# Altium schematic sheet 005_DCDC & PMIC.SchDoc
size 420 x 297 mm; Page Create Date: May 29, 2006; WebSite: https://www.seeedstudio.com; Page Number: 5; Drawing: qxn; Schematic Name: BeaglePlay; Page Size: A3; Comment: Seeed Title; Page Count: 22; Page Name: 005_DCDC & PMIC; Company: Seeed Studio; RevCode: v0.2; DsnPath: C:\Users\a0488739\Documents\GitHub\beagleplay\allegro\DVT\BEAGLEPLAYV020_220915.DSN; SchematicName: BeaglePlay; PageName: 005_DCDC & PMIC; PageSize: A3; TopSchematic: True
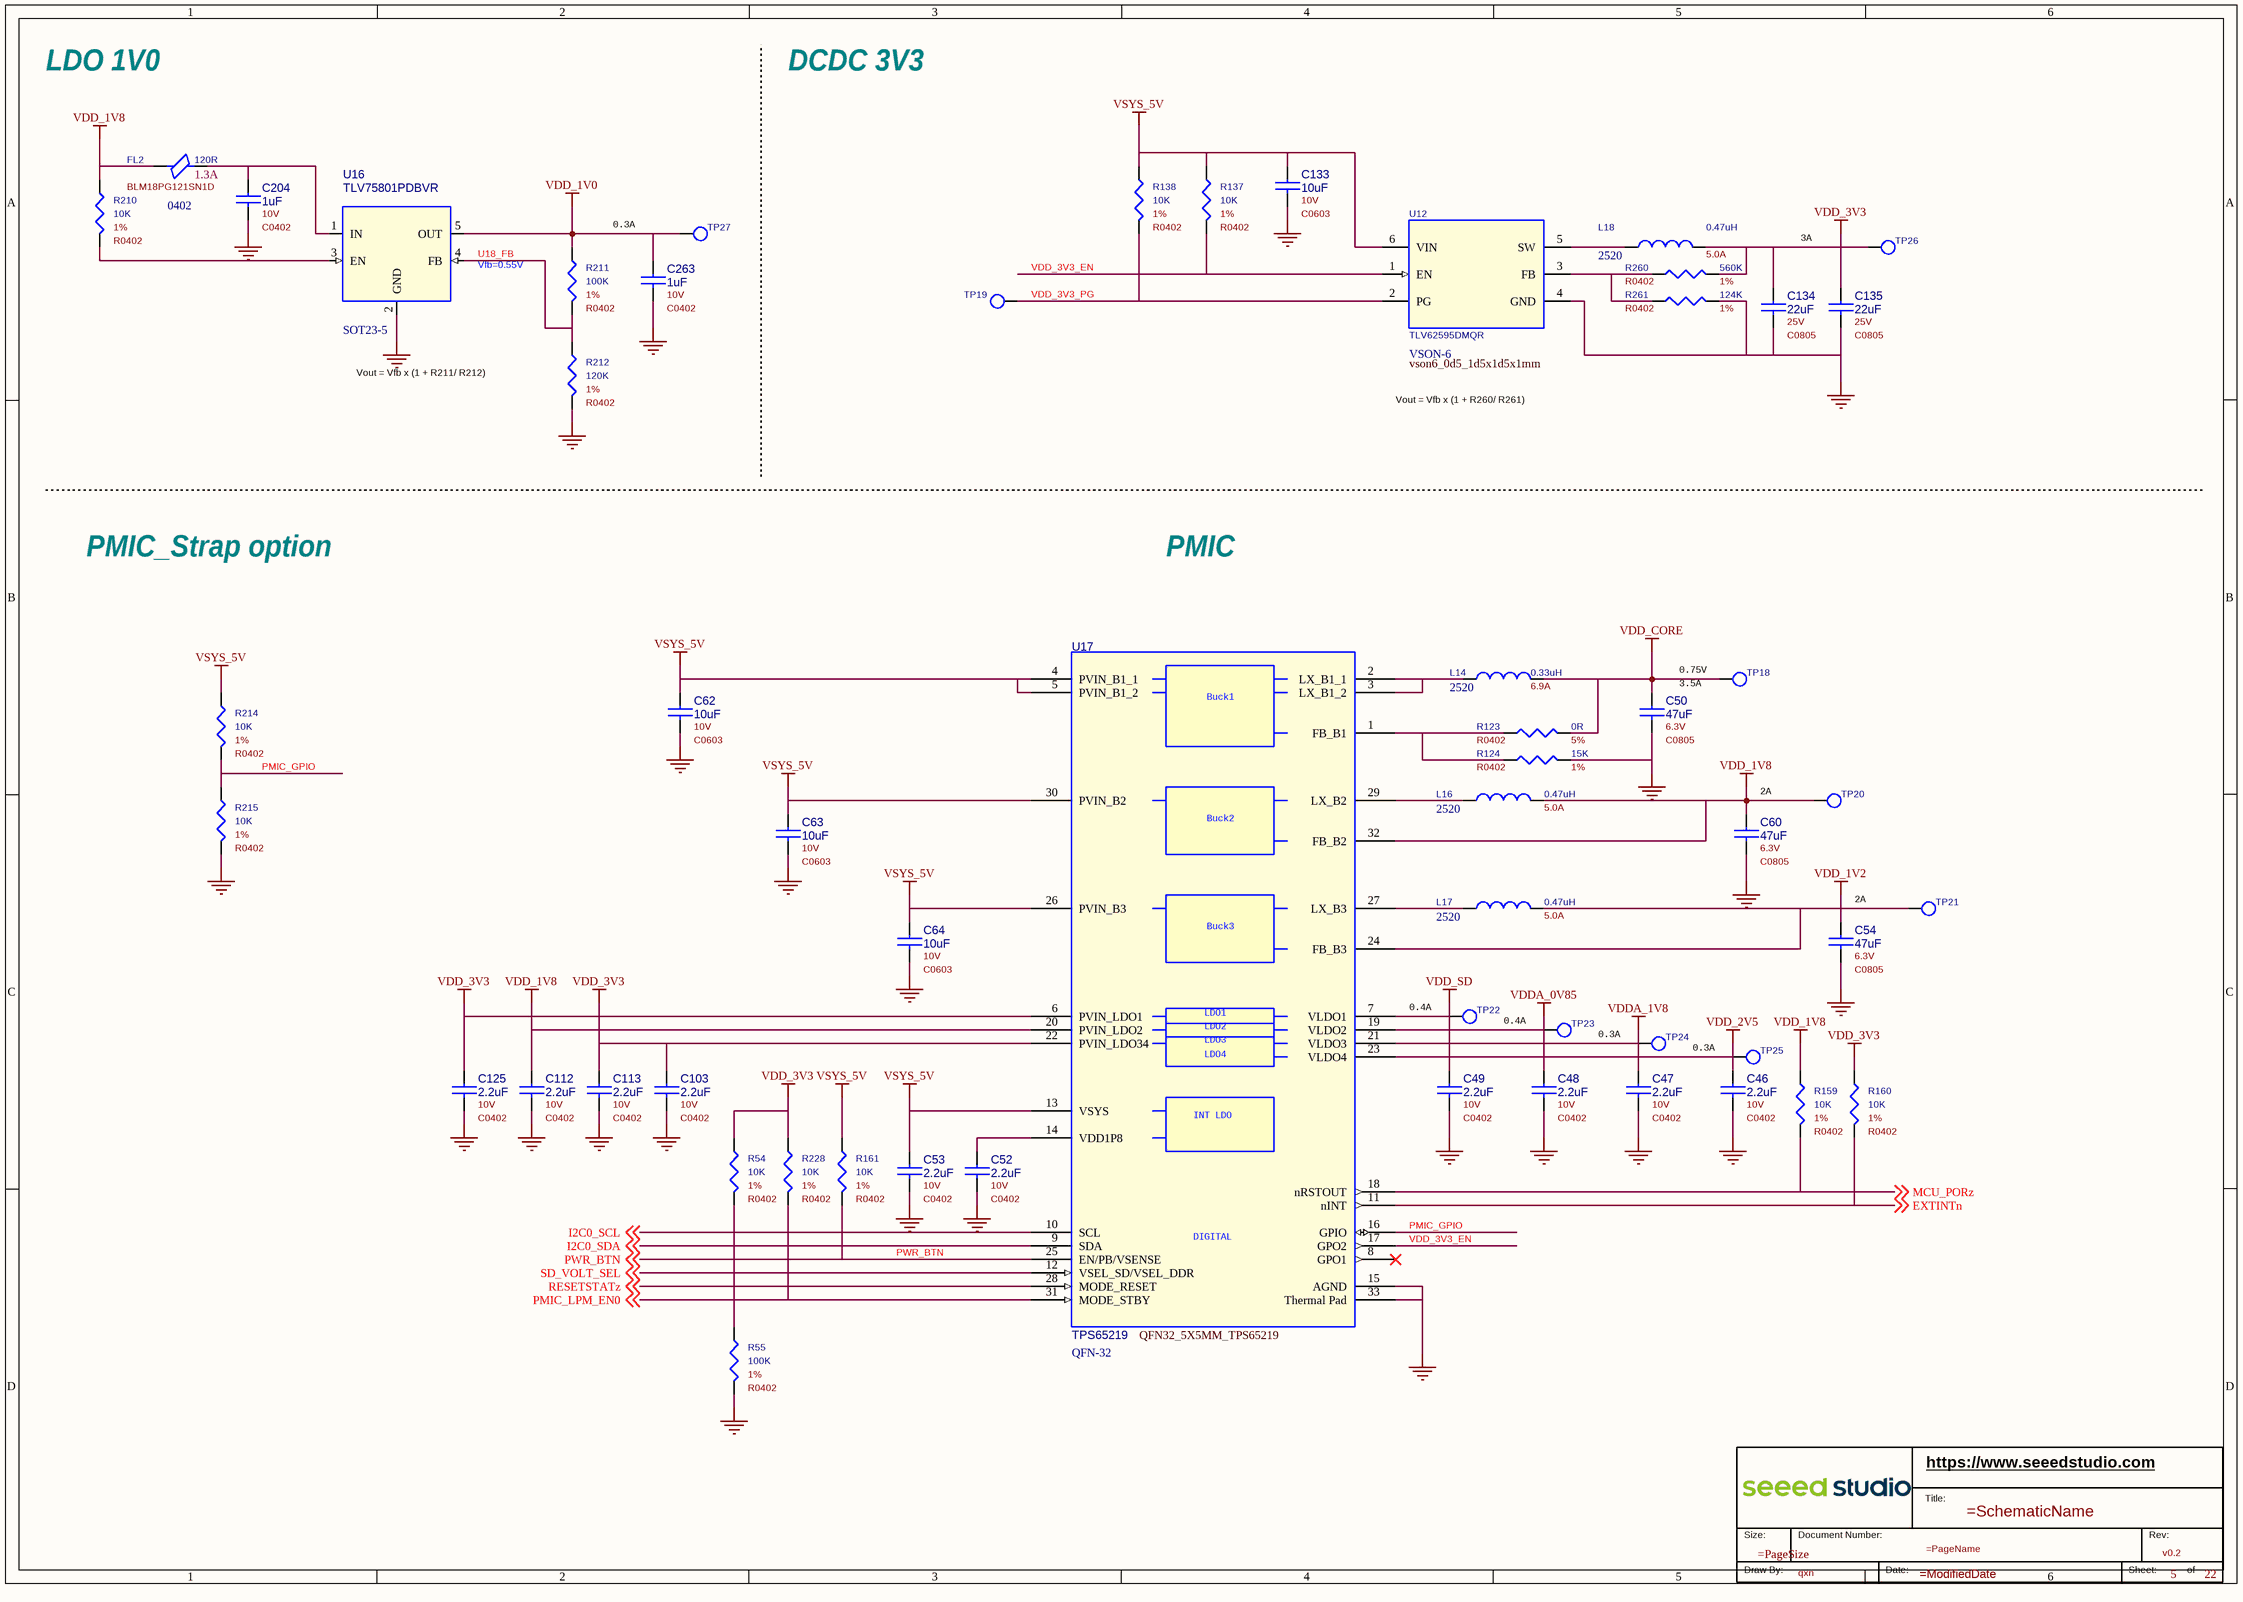
[diagram p0: 005_DCDC & PMIC.SchDoc]

## Parts
*  RevCode: v0.2  Page Number: 5  Page Count: 22  Drawing: qxn  (hidden comment: Seeed Title)  (graphical)
C46  value 2.2uF  Rating: 10V  [C0402]  (hidden comment: CC)
C47  value 2.2uF  Rating: 10V  [C0402]  (hidden comment: CC)
C48  value 2.2uF  Rating: 10V  [C0402]  (hidden comment: CC)
C49  value 2.2uF  Rating: 10V  [C0402]  (hidden comment: CC)
C50  value 47uF  Rating: 6.3V  [C0805]  (hidden comment: CC)
C52  value 2.2uF  Rating: 10V  [C0402]  (hidden comment: CC)
C53  value 2.2uF  Rating: 10V  [C0402]  (hidden comment: CC)
C54  value 47uF  Rating: 6.3V  [C0805]  (hidden comment: CC)
C60  value 47uF  Rating: 6.3V  [C0805]  (hidden comment: CC)
C62  value 10uF  Rating: 10V  [C0603]  (hidden comment: CC)
C63  value 10uF  Rating: 10V  [C0603]  (hidden comment: CC)
C64  value 10uF  Rating: 10V  [C0603]  (hidden comment: CC)
C103  value 2.2uF  Rating: 10V  [C0402]  (hidden comment: CC)
C112  value 2.2uF  Rating: 10V  [C0402]  (hidden comment: CC)
C113  value 2.2uF  Rating: 10V  [C0402]  (hidden comment: CC)
C125  value 2.2uF  Rating: 10V  [C0402]  (hidden comment: CC)
C133  value 10uF  Rating: 10V  [C0603]  (hidden comment: CC)
C134  value 22uF  Rating: 25V  [C0805]  (hidden comment: CC)
C135  value 22uF  Rating: 25V  [C0805]  (hidden comment: CC)
C204  value 1uF  Rating: 10V  [C0402]  (hidden comment: CC)
C263  value 1uF  Rating: 10V  [C0402]  (hidden comment: CC)
FL2  value 120R  Rating: 1.3A  Manufacturer Part Number: BLM18PG121SN1D  Package Size: 0402  [L0402]  (hidden comment: FB)
L14  value 0.33uH  Rating: 6.9A  Package Size: 2520  [L1008]  (hidden comment: L)
L16  value 0.47uH  Rating: 5.0A  Package Size: 2520  [L1008]  (hidden comment: L)
L17  value 0.47uH  Rating: 5.0A  Package Size: 2520  [L1008]  (hidden comment: L)
L18  value 0.47uH  Rating: 5.0A  Package Size: 2520  [L1008]  (hidden comment: L)
R54  value 10K  Rating: 1%  [R0402]  (hidden comment: R)
R55  value 100K  Rating: 1%  [R0402]  (hidden comment: R)
R123  value 0R  Rating: 5%  [R0402]  (hidden comment: R)
R124  value 15K  Rating: 1%  [R0402]  (hidden comment: R)
R137  value 10K  Rating: 1%  [R0402]  (hidden comment: R)
R138  value 10K  Rating: 1%  [R0402]  (hidden comment: R)
R159  value 10K  Rating: 1%  [R0402]  (hidden comment: R)
R160  value 10K  Rating: 1%  [R0402]  (hidden comment: R)
R161  value 10K  Rating: 1%  [R0402]  (hidden comment: R)
R210  value 10K  Rating: 1%  [R0402]  (hidden comment: R)
R211  value 100K  Rating: 1%  [R0402]  (hidden comment: R)
R212  value 120K  Rating: 1%  [R0402]  (hidden comment: R)
R214  value 10K  Rating: 1%  [R0402]  (hidden comment: R)
R215  value 10K  Rating: 1%  [R0402]  (hidden comment: R)
R228  value 10K  Rating: 1%  [R0402]  (hidden comment: R)
R260  value 560K  Rating: 1%  [R0402]  (hidden comment: R)
R261  value 124K  Rating: 1%  [R0402]  (hidden comment: R)
TP18  Test Point  [tp1-8040]  (value not drawn)
TP19  Test Point  [tp1-8040]  (value not drawn)
TP20  Test Point  [tp1-8040]  (value not drawn)
TP21  Test Point  [tp1-8040]  (value not drawn)
TP22  Test Point  [tp1-8040]  (value not drawn)
TP23  Test Point  [tp1-8040]  (value not drawn)
TP24  Test Point  [tp1-8040]  (value not drawn)
TP25  Test Point  [tp1-8040]  (value not drawn)
TP26  Test Point  [tp1-8040]  (value not drawn)
TP27  Test Point  [tp1-8040]  (value not drawn)
U12  Package Size: VSON-6  [vson6_0d5_1d5x1d5x1mm]  (hidden comment: TLV62595DMQR)
U16  value TLV75801PDBVR  [SOT23-5]  (hidden comment: LDO_5P_FB_EN)
U17  Package Size: QFN-32  [QFN32_5X5MM_TPS65219]  (hidden comment: TPS65219)

## Nets
GND: C46.2 C47.2 C48.2 C49.2 C50.2 C52.2 C53.2 C54.2 C60.2 C62.2 C63.2 C64.2 C103.2 C112.2 C113.2 C125.2 C133.2 C134.2 C135.2 C204.2 C263.2 R55.2 R124.2 R212.2 R215.2 R261.2 U12.4(GND) U16.2(GND) U17.15(AGND) U17.33(Thermal_Pad)
VDD_1V0: C263.1 R211.1 TP27.1(TP) U16.5(OUT)
VDD_1V2: C54.1 L17.2 TP21.1(TP) U17.24(FB_B3)
VDD_1V8: C60.1 C112.1 FL2.1 L16.2 R159.1 R210.1 TP20.1(TP) U17.20(PVIN_LDO2) U17.32(FB_B2)
VDD_2V5: C46.1 TP25.1(TP) U17.23(VLDO4)
VDD_3V3: C103.1 C113.1 C125.1 C134.1 C135.1 L18.2 R54.1 R160.1 R228.1 R260.2 TP26.1(TP) U17.6(PVIN_LDO1) U17.22(PVIN_LDO34)
VDD_CORE: C50.1 L14.2 R123.2 TP18.1(TP)
VDD_SD: C49.1 TP22.1(TP) U17.7(VLDO1)
VDDA_0V85: C48.1 TP23.1(TP) U17.19(VLDO2)
VDDA_1V8: C47.1 TP24.1(TP) U17.21(VLDO3)
VSYS_5V: C53.1 C62.1 C63.1 C64.1 C133.1 R137.1 R138.1 R161.1 R214.1 U12.6(VIN) U17.4(PVIN_B1_1) U17.5(PVIN_B1_2) U17.13(VSYS) U17.26(PVIN_B3) U17.30(PVIN_B2)
EXTINTn: R160.2 U17.11(nINT) ; off-sheet EXTINTn
I2C0_SCL: U17.10(SCL) ; off-sheet I2C0_SCL
I2C0_SDA: U17.9(SDA) ; off-sheet I2C0_SDA
MCU_PORz: R159.2 U17.18(nRSTOUT) ; off-sheet MCU_PORz
PMIC_GPIO: R214.2 R215.1 U17.16(GPIO)
PMIC_LPM_EN0: R228.2 U17.31(MODE_STBY) ; off-sheet PMIC_LPM_EN0
PWR_BTN: R161.2 U17.25(EN/PB/VSENSE) ; off-sheet PWR_BTN
RESETSTATz: U17.28(MODE_RESET) ; off-sheet RESETSTATz
SD_VOLT_SEL: R54.2 R55.1 U17.12(VSEL_SD/VSEL_DDR) ; off-sheet SD_VOLT_SEL
U18_FB: R211.2 R212.1 U16.4(FB)
VDD_3V3_EN: R137.2 U12.1(EN) U17.17(GPO2)
VDD_3V3_PG: R138.2 TP19.1(TP) U12.2(PG)
NetC52_1: C52.1 U17.14(VDD1P8)
NetC204_1: C204.1 FL2.2 U16.1(IN)
NetL14_1: L14.1 U17.2(LX_B1_1) U17.3(LX_B1_2)
NetL16_1: L16.1 U17.29(LX_B2)
NetL17_1: L17.1 U17.27(LX_B3)
NetL18_1: L18.1 U12.5(SW)
NetR123_1: R123.1 R124.1 U17.1(FB_B1)
NetR210_2: R210.2 U16.3(EN)
NetR260_1: R260.1 R261.1 U12.3(FB)

Not connected (* = marked no-connect by the designer): U17 8(GPO1)*

## Notes on the sheet
- LDO 1V0
- DCDC 3V3
- 0.3A
- 3A
- (near U16) Vfb=0.55V
- Vout = Vfb x (1 + R211/ R212)
- Vout = Vfb x (1 + R260/ R261)
- PMIC_Strap option
- PMIC
- 0.75V
- 3.5A
- (near C60) 2A
- (near C54) 2A
- 0.4A
- (in symbol Seeed Title) https://www.seeedstudio.com; Title:; Size:; Document Number:; Rev:; Draw By:; Date:; Sheet:; of
- (in symbol TPS65219) Buck1; Buck2; Buck3; LDO1; LDO2; LDO3; LDO4; INT LDO; DIGITAL

## Library data of the parts
* = Seeed Title: Company: Seeed Studio; WebSite: https://www.seeedstudio.com; Schematic Name: =SchematicName; Page Size: =PageSize; Page Name: =PageName; Page Create Date: May 29, 2006; Page Modify Date: =ModifiedDate
C46 = CC: CAP, Ceramic, SMD, 2.2uF, 10%, 10V, 0402; Part Reference: C46; Manufacturer PN: CC0402KRX5R6BB225; Manufacturer: YAGEO; Company Part Status: BeagleConnect_Robotics_Joystick; CLASS: DISCRETE; Temperature Coefficient: X5R; PN: 302012819; PCB Footprint: C0402; Tolerance: 10%; Dielectric Type: Ceramic; Package Size: 0402
C47 = CC: CAP, Ceramic, SMD, 2.2uF, 10%, 10V, 0402; Part Reference: C47; Company Part Status: BeagleConnect_Robotics_Joystick; Manufacturer: YAGEO; Manufacturer PN: CC0402KRX5R6BB225; PN: 302012819; Temperature Coefficient: X5R; CLASS: DISCRETE; PCB Footprint: C0402; Package Size: 0402; Dielectric Type: Ceramic; Tolerance: 10%
C48 = CC: CAP, Ceramic, SMD, 2.2uF, 10%, 10V, 0402; Part Reference: C48; Manufacturer PN: CC0402KRX5R6BB225; Manufacturer: YAGEO; Company Part Status: BeagleConnect_Robotics_Joystick; CLASS: DISCRETE; Temperature Coefficient: X5R; PN: 302012819; PCB Footprint: C0402; Tolerance: 10%; Dielectric Type: Ceramic; Package Size: 0402
C49 = CC: CAP, Ceramic, SMD, 2.2uF, 10%, 10V, 0402; Part Reference: C49; Company Part Status: BeagleConnect_Robotics_Joystick; Manufacturer: YAGEO; Manufacturer PN: CC0402KRX5R6BB225; PN: 302012819; Temperature Coefficient: X5R; CLASS: DISCRETE; PCB Footprint: C0402; Package Size: 0402; Dielectric Type: Ceramic; Tolerance: 10%
C50 = CC: CAP, Ceramic, SMD, 47uF, 20%, 6.3V, 0805; Part Reference: C50; Manufacturer PN: CC0805MKX5R5BB476; Manufacturer: YAGEO; Company Part Status: Sensor Hub; CLASS: DISCRETE; Temperature Coefficient: X5R; PN: 302010166; PCB Footprint: C0805; Tolerance: 20%; Dielectric Type: Ceramic; Package Size: 0805
C52 = CC: CAP, Ceramic, SMD, 2.2uF, 10%, 10V, 0402; Part Reference: C52; Company Part Status: BeagleConnect_Robotics_Joystick; Manufacturer: YAGEO; Manufacturer PN: CC0402KRX5R6BB225; PN: 302012819; Temperature Coefficient: X5R; CLASS: DISCRETE; PCB Footprint: C0402; Package Size: 0402; Dielectric Type: Ceramic; Tolerance: 10%
C53 = CC: CAP, Ceramic, SMD, 2.2uF, 10%, 10V, 0402; Part Reference: C53; Company Part Status: BeagleConnect_Robotics_Joystick; Manufacturer: YAGEO; Manufacturer PN: CC0402KRX5R6BB225; PN: 302012819; Temperature Coefficient: X5R; CLASS: DISCRETE; PCB Footprint: C0402; Package Size: 0402; Dielectric Type: Ceramic; Tolerance: 10%
C54 = CC: CAP, Ceramic, SMD, 47uF, 20%, 6.3V, 0805; Part Reference: C54; Manufacturer PN: CC0805MKX5R5BB476; Manufacturer: YAGEO; Company Part Status: Sensor Hub; CLASS: DISCRETE; Temperature Coefficient: X5R; PN: 302010166; PCB Footprint: C0805; Tolerance: 20%; Dielectric Type: Ceramic; Package Size: 0805
C60 = CC: CAP, Ceramic, SMD, 47uF, 20%, 6.3V, 0805; Part Reference: C60; Manufacturer PN: CC0805MKX5R5BB476; Manufacturer: YAGEO; Company Part Status: Sensor Hub; CLASS: DISCRETE; Temperature Coefficient: X5R; PN: 302010166; PCB Footprint: C0805; Tolerance: 20%; Dielectric Type: Ceramic; Package Size: 0805
C62 = CC: CAP, Ceramic, SMD, 10uF, 10%, 10V, 0603; Part Reference: C62; Manufacturer PN: CC0603KRX5R6BB106; Manufacturer: YAGEO; Company Part Status: BeagleBone Carrier Board; CLASS: DISCRETE; Temperature Coefficient: X5R; PN: 302010103; PCB Footprint: C0603; Tolerance: 10%; Dielectric Type: Ceramic; Package Size: 0603
C63 = CC: CAP, Ceramic, SMD, 10uF, 10%, 10V, 0603; Part Reference: C63; Manufacturer PN: CC0603KRX5R6BB106; Manufacturer: YAGEO; Company Part Status: BeagleBone Carrier Board; CLASS: DISCRETE; Temperature Coefficient: X5R; PN: 302010103; PCB Footprint: C0603; Tolerance: 10%; Dielectric Type: Ceramic; Package Size: 0603
C64 = CC: CAP, Ceramic, SMD, 10uF, 10%, 10V, 0603; Part Reference: C64; Company Part Status: BeagleBone Carrier Board; Manufacturer: YAGEO; Manufacturer PN: CC0603KRX5R6BB106; PN: 302010103; Temperature Coefficient: X5R; CLASS: DISCRETE; PCB Footprint: C0603; Package Size: 0603; Dielectric Type: Ceramic; Tolerance: 10%
C103 = CC: CAP, Ceramic, SMD, 2.2uF, 10%, 10V, 0402; Part Reference: C103; Manufacturer PN: CC0402KRX5R6BB225; Manufacturer: YAGEO; Company Part Status: BeagleConnect_Robotics_Joystick; CLASS: DISCRETE; Temperature Coefficient: X5R; PN: 302012819; PCB Footprint: C0402; Tolerance: 10%; Dielectric Type: Ceramic; Package Size: 0402
C112 = CC: CAP, Ceramic, SMD, 2.2uF, 10%, 10V, 0402; Part Reference: C112; Company Part Status: BeagleConnect_Robotics_Joystick; Manufacturer: YAGEO; Manufacturer PN: CC0402KRX5R6BB225; PN: 302012819; Temperature Coefficient: X5R; CLASS: DISCRETE; PCB Footprint: C0402; Package Size: 0402; Dielectric Type: Ceramic; Tolerance: 10%
C113 = CC: CAP, Ceramic, SMD, 2.2uF, 10%, 10V, 0402; Part Reference: C113; Manufacturer PN: CC0402KRX5R6BB225; Manufacturer: YAGEO; Company Part Status: BeagleConnect_Robotics_Joystick; CLASS: DISCRETE; Temperature Coefficient: X5R; PN: 302012819; PCB Footprint: C0402; Tolerance: 10%; Dielectric Type: Ceramic; Package Size: 0402
C125 = CC: CAP, Ceramic, SMD, 2.2uF, 10%, 10V, 0402; Part Reference: C125; Manufacturer PN: CC0402KRX5R6BB225; Manufacturer: YAGEO; Company Part Status: BeagleConnect_Robotics_Joystick; CLASS: DISCRETE; Temperature Coefficient: X5R; PN: 302012819; PCB Footprint: C0402; Tolerance: 10%; Dielectric Type: Ceramic; Package Size: 0402
C133 = CC: CAP, Ceramic, SMD, 10uF, 10%, 10V, 0603; Part Reference: C133; Company Part Status: BeagleBone Carrier Board; Manufacturer: YAGEO; Manufacturer PN: CC0603KRX5R6BB106; PN: 302010103; Temperature Coefficient: X5R; CLASS: DISCRETE; PCB Footprint: C0603; Package Size: 0603; Dielectric Type: Ceramic; Tolerance: 10%
C134 = CC: CAP, Ceramic, SMD, 22uF, 20%, 25V, 0805; Part Reference: C134; Company Part Status: SenseCAP SOLO CO2 v1.0; Manufacturer: YAGEO; Manufacturer PN: CC0805MKX5R8BB226; PN: 302010235; Temperature Coefficient: X5R; CLASS: DISCRETE; PCB Footprint: C0805; Package Size: 0805; Dielectric Type: Ceramic; Tolerance: 20%
C135 = CC: CAP, Ceramic, SMD, 22uF, 20%, 25V, 0805; Part Reference: C135; Company Part Status: SenseCAP SOLO CO2 v1.0; Manufacturer: YAGEO; Manufacturer PN: CC0805MKX5R8BB226; PN: 302010235; Temperature Coefficient: X5R; CLASS: DISCRETE; PCB Footprint: C0805; Package Size: 0805; Dielectric Type: Ceramic; Tolerance: 20%
C204 = CC: CAP, Ceramic, SMD, 1uF, 10%, 10V, 0402; Part Reference: C204; Manufacturer: YAGEO; Manufacturer Part Number: CC0402KRX5R6BB105; Company Part Status: BeagleBone Carrier Board; PN: 302010040; Temperature Coefficient: X5R; CLASS: DISCRETE; PCB Footprint: C0402; Part Type: Ceramic; Status: BeagleBone Carrier Board; Temperature: -55¡ãC to 85¡ãC; Package Size: 0402; Dielectric Type: Ceramic; Tolerance: 10%; Manufacturer PN: CC0402KRX5R6BB105
C263 = CC: CAP, Ceramic, SMD, 1uF, 10%, 10V, 0402; Part Reference: C263; Manufacturer Part Number: CC0402KRX5R6BB105; Manufacturer: YAGEO; Company Part Status: BeagleBone Carrier Board; PN: 302010040; Temperature Coefficient: X5R; CLASS: DISCRETE; PCB Footprint: C0402; Temperature: -55¡ãC to 85¡ãC; Status: BeagleBone Carrier Board; Part Type: Ceramic; Package Size: 0402; Dielectric Type: Ceramic; Tolerance: 10%; Manufacturer PN: CC0402KRX5R6BB105
FL2 = FB: Ferrite Bead, 120R, , 1.3A, 0402; Part Reference: FL2; Manufacturer: Murata; Company Part Status: BeagleBone Carrier Board; Manufacturer PN: BLM15PD121SN1D; PN: 303030040; CLASS: DISCRETE; PCB Footprint: L0402; Part Type: Ferrite Bead; Status: BeagleBone Carrier Board; Temperature: -55¡ãC to 125¡ãC
L14 = L: Power Inductor, 0.33uH, 20%, 6.9A, 2520; Part Reference: L14; Manufacturer PN: CSTB252012H-R33M; Manufacturer: CODACA; Company Part Status: BealgePlay; CLASS: DISCRETE; PN: 303011708; PCB Footprint: L1008
L16 = L: Power Inductor, 0.47uH, 20%, 5.0A, 2520; Part Reference: L16; Manufacturer PN: CSTB252012H-R47M; Manufacturer: CODACA; Company Part Status: BealgePlay; CLASS: DISCRETE; PN: 303011709; PCB Footprint: L1008
L17 = L: Power Inductor, 0.47uH, 20%, 5.0A, 2520; Part Reference: L17; Manufacturer PN: CSTB252012H-R47M; Manufacturer: CODACA; Company Part Status: BealgePlay; CLASS: DISCRETE; PN: 303011709; PCB Footprint: L1008
L18 = L: Power Inductor, 0.47uH, 20%, 5.0A, 2520; Part Reference: L18; Manufacturer PN: CSTB252012H-R47M; Manufacturer: CODACA; Company Part Status: BealgePlay; CLASS: DISCRETE; PN: 303011709; PCB Footprint: L1008
R54 = R: RES, Thick Film, 10K, 1%, 1/16W, SMD, 0402; Part Reference: R54; Company Part Status: BeagleBone Carrier Board; Manufacturer: YAGEO; Manufacturer PN: RC0402FR-0710KL; PN: 301010047; CLASS: DISCRETE; PCB Footprint: R0402; Package Size: 0402; Rated Power: 1/16W
R55 = R: RES, Thick Film, 100K, 1%, 1/16W, SMD, 0402; Part Reference: R55; Manufacturer Part Number: RC0402FR-07100KL; Manufacturer: YAGEO; Company Part Status: BeagleBone Carrier Board; PN: 301010456; CLASS: DISCRETE; PCB Footprint: R0402; Temperature: -55¡ãC to 155¡ãC; Status: BeagleBone Carrier Board; Part Type: RES; Package Size: 0402; Rated Power: 1/16W; Manufacturer PN: RC0402FR-07100KL
R123 = R: RES, Thick Film, 0R, 5%, 1/16W, SMD, 0402; Part Reference: R123; Manufacturer PN: RC0402JR-070RL; Manufacturer: YAGEO; Company Part Status: BeagleBone Carrier Board; CLASS: DISCRETE; PN: 301010000; PCB Footprint: R0402; Rated Power: 1/16W; Package Size: 0402
R124 = R: RES, Thick Film, 15K, 1%, 1/16W, SMD, 0402; Part Reference: R124; Manufacturer PN: RC0402FR-0715KL; Manufacturer: YAGEO; Company Part Status: IOT Enabling Dongle Board; CLASS: DISCRETE; PN: 301010738; PCB Footprint: R0402; Rated Power: 1/16W; Package Size: 0402
R137 = R: RES, Thick Film, 10K, 1%, 1/16W, SMD, 0402; Part Reference: R137; Company Part Status: BeagleBone Carrier Board; Manufacturer: YAGEO; Manufacturer PN: RC0402FR-0710KL; PN: 301010047; CLASS: DISCRETE; PCB Footprint: R0402; Rated Power: 1/16W; Package Size: 0402
R138 = R: RES, Thick Film, 10K, 1%, 1/16W, SMD, 0402; Part Reference: R138; Company Part Status: BeagleBone Carrier Board; Manufacturer: YAGEO; Manufacturer PN: RC0402FR-0710KL; PN: 301010047; CLASS: DISCRETE; PCB Footprint: R0402; Rated Power: 1/16W; Package Size: 0402
R159 = R: RES, Thick Film, 10K, 1%, 1/16W, SMD, 0402; Part Reference: R159; Company Part Status: BeagleBone Carrier Board; Manufacturer: YAGEO; Manufacturer PN: RC0402FR-0710KL; PN: 301010047; CLASS: DISCRETE; PCB Footprint: R0402; Package Size: 0402; Rated Power: 1/16W
R160 = R: RES, Thick Film, 10K, 1%, 1/16W, SMD, 0402; Part Reference: R160; Company Part Status: BeagleBone Carrier Board; Manufacturer: YAGEO; Manufacturer PN: RC0402FR-0710KL; PN: 301010047; CLASS: DISCRETE; PCB Footprint: R0402; Package Size: 0402; Rated Power: 1/16W
R161 = R: RES, Thick Film, 10K, 1%, 1/16W, SMD, 0402; Part Reference: R161; Company Part Status: BeagleBone Carrier Board; Manufacturer: YAGEO; Manufacturer PN: RC0402FR-0710KL; PN: 301010047; CLASS: DISCRETE; PCB Footprint: R0402; Package Size: 0402; Rated Power: 1/16W
R210 = R: RES, Thick Film, 10K, 1%, 1/16W, SMD, 0402; Part Reference: R210; Manufacturer Part Number: RC0201FR-0710KL; Manufacturer: YAGEO; Company Part Status: BeagleBone Carrier Board; Manufacturer PN: RC0402FR-0710KL; PN: 301010047; CLASS: DISCRETE; PCB Footprint: R0402; Rated Power: 1/16W; Temperature: -55¡ãC to 125¡ãC; Status: BeagleBone AI TDA4VM; Part Type: RES; Package Size: 0402
R211 = R: RES, Thick Film, 100K, 1%, 1/16W, SMD, 0402; Part Reference: R211; Manufacturer Part Number: RC0402FR-07100KL; Manufacturer: YAGEO; Company Part Status: BeagleBone Carrier Board; PN: 301010456; CLASS: DISCRETE; PCB Footprint: R0402; Temperature: -55¡ãC to 155¡ãC; Status: BeagleBone Carrier Board; Part Type: RES; Package Size: 0402; Rated Power: 1/16W; Manufacturer PN: RC0402FR-07100KL
R212 = R: RES, Thick Film, 120K, 1%, 1/16W, SMD, 0402; Part Reference: R212; Manufacturer: YAGEO; Manufacturer Part Number: RC0402FR-07120KL; Company Part Status: BeagleBone Carrier Board; PN: 301010518; CLASS: DISCRETE; PCB Footprint: R0402; Part Type: RES; Status: BeagleBone Carrier Board; Temperature: -55¡ãC to 155¡ãC; Package Size: 0402; Rated Power: 1/16W; Manufacturer PN: RC0402FR-07120KL
R214 = R: RES, Thick Film, 10K, 1%, 1/16W, SMD, 0402; Part Reference: R214; Company Part Status: BeagleBone Carrier Board; Manufacturer: YAGEO; Manufacturer PN: RC0402FR-0710KL; PN: 301010047; CLASS: DISCRETE; PCB Footprint: R0402; Rated Power: 1/16W; Package Size: 0402
R215 = R: RES, Thick Film, 10K, 1%, 1/16W, SMD, 0402; Part Reference: R215; Company Part Status: BeagleBone Carrier Board; Manufacturer: YAGEO; Manufacturer PN: RC0402FR-0710KL; PN: 301010047; CLASS: DISCRETE; PCB Footprint: R0402; Rated Power: 1/16W; Package Size: 0402
R228 = R: RES, Thick Film, 10K, 1%, 1/16W, SMD, 0402; Part Reference: R228; Manufacturer PN: RC0402FR-0710KL; Manufacturer: YAGEO; Company Part Status: BeagleBone Carrier Board; CLASS: DISCRETE; PN: 301010047; PCB Footprint: R0402; Package Size: 0402; Rated Power: 1/16W
R260 = R: RES, Thick Film, 560K, 1%, 1/16W, SMD, 0402; Part Reference: R260; Company Part Status: BeagleBone Carrier Board; Manufacturer: YAGEO; Manufacturer PN: RC0402FR-07560KL; PN: 301011226; CLASS: DISCRETE; PCB Footprint: R0402; Package Size: 0402; Rated Power: 1/16W
R261 = R: RES, Thick Film, 124K, 1%, 1/16 W, SMD, 0402; Part Reference: R261; Manufacturer PN: RC0402FR-07124KL; Manufacturer: YAGEO; CLASS: DISCRETE; Rated Power: 1/16 W; Temperature Coefficient: +/-200 ppm; PN: 301010860; PCB Footprint: R0402; Package Size: 0402
TP18 = Test Point: MISC, Test Point, Test Point, SMD, TP35S_SMD; Part Reference: TP18; Company Part Status: Mini-Gateway; ASSY: DNP; CLASS: DISCRETE; PCB Footprint: TP35S_SMD; Value: Test Point; PN: TP35S_SMD; Package Size: TP35S_SMD
TP19 = Test Point: MISC, Test Point, Test Point, SMD, TP35S_SMD; Part Reference: TP19; Company Part Status: Mini-Gateway; ASSY: DNP; CLASS: DISCRETE; PCB Footprint: TP35S_SMD; Value: Test Point; PN: TP35S_SMD; Package Size: TP35S_SMD
TP20 = Test Point: MISC, Test Point, Test Point, SMD, TP35S_SMD; Part Reference: TP20; Company Part Status: Mini-Gateway; ASSY: DNP; CLASS: DISCRETE; PCB Footprint: TP35S_SMD; Value: Test Point; PN: TP35S_SMD; Package Size: TP35S_SMD
TP21 = Test Point: MISC, Test Point, Test Point, SMD, TP35S_SMD; Part Reference: TP21; Company Part Status: Mini-Gateway; ASSY: DNP; CLASS: DISCRETE; PCB Footprint: TP35S_SMD; Value: Test Point; PN: TP35S_SMD; Package Size: TP35S_SMD
TP22 = Test Point: MISC, Test Point, Test Point, SMD, TP35S_SMD; Part Reference: TP22; Company Part Status: Mini-Gateway; ASSY: DNP; CLASS: DISCRETE; PCB Footprint: TP35S_SMD; Value: Test Point; PN: TP35S_SMD; Package Size: TP35S_SMD
TP23 = Test Point: MISC, Test Point, Test Point, SMD, TP35S_SMD; Part Reference: TP23; Company Part Status: Mini-Gateway; ASSY: DNP; CLASS: DISCRETE; PCB Footprint: TP35S_SMD; Value: Test Point; PN: TP35S_SMD; Package Size: TP35S_SMD
TP24 = Test Point: MISC, Test Point, Test Point, SMD, TP35S_SMD; Part Reference: TP24; Company Part Status: Mini-Gateway; ASSY: DNP; CLASS: DISCRETE; PCB Footprint: TP35S_SMD; Value: Test Point; PN: TP35S_SMD; Package Size: TP35S_SMD
TP25 = Test Point: MISC, Test Point, Test Point, SMD, TP35S_SMD; Part Reference: TP25; Company Part Status: Mini-Gateway; ASSY: DNP; CLASS: DISCRETE; PCB Footprint: TP35S_SMD; Value: Test Point; PN: TP35S_SMD; Package Size: TP35S_SMD
TP26 = Test Point: MISC, Test Point, Test Point, SMD, TP35S_SMD; Part Reference: TP26; Company Part Status: Mini-Gateway; ASSY: DNP; CLASS: DISCRETE; PCB Footprint: TP35S_SMD; Value: Test Point; Package Size: TP35S_SMD; PN: TP35S_SMD
TP27 = Test Point: MISC, Test Point, Test Point, SMD, TP35S_SMD; Part Reference: TP27; Company Part Status: Mini-Gateway; ASSY: DNP; CLASS: DISCRETE; PCB Footprint: TP35S_SMD; Value: Test Point; Package Size: TP35S_SMD; PN: TP35S_SMD
U12 = TLV62595DMQR: IC, PMIC, DCDC, TLV62595DMQR, VSON-6; Part Reference: U12; Manufacturer: TI; Company Part Status: BeaglePlay; PN: 310032516; PCB Footprint: vson6_0d5_1d5x1d5x1mm; Value: TLV62595DMQR; Manufacturer PN: TLV62595DMQR; CLASS: IC
U16 = LDO_5P_FB_EN: IC, PMIC, LDO, TLV75801PDBVR, SOT23-5; Part Reference: U16; Company Part Status: BeaglePlay; Manufacturer: TI; Priority: A; Rating: 500mA; PN: 310032000; PCB Footprint: SOT23-5; Manufacturer PN: TLV75801PDBVR; CLASS: IC; Package Size: SOT23-5; Temperature: -40¡ãC to 125¡ãC; Status: BeagleBone AI TDA4VM; Part Type: LDO; Manufacturer Part Number: TLV75801PDBVR
U17 = TPS65219: IC, PMIC, PMIC, TPS65219, QFN-32; Part Reference: U17; Manufacturer PN: TPS6521901RHBR; Manufacturer: TI; Company Part Status: BeaglePlay; PN: 310032517; PCB Footprint: QFN32_5X5MM_TPS65219; Value: TPS65219; CLASS: IC